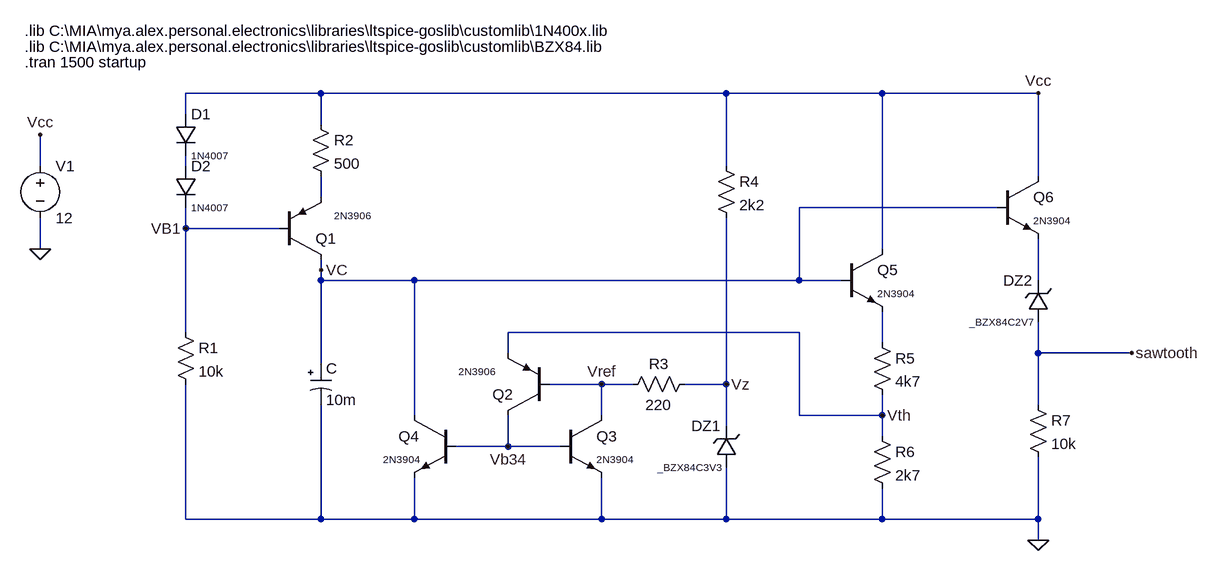
[diagram p0: schematic sawtooth.asc]
sawtooth.asc, the LTspice schematic file:
Version 4
SHEET 1 1076 740
WIRE -1648 -64 -1856 -64
WIRE -1024 -64 -1648 -64
WIRE -784 -64 -1024 -64
WIRE -544 -64 -784 -64
WIRE -1856 -32 -1856 -64
WIRE -1648 -16 -1648 -64
WIRE -2080 48 -2080 0
WIRE -1856 48 -1856 32
WIRE -1024 48 -1024 -64
WIRE -544 64 -544 -64
WIRE -1648 96 -1648 64
WIRE -608 112 -912 112
WIRE -1856 144 -1856 112
WIRE -1712 144 -1856 144
WIRE -2080 176 -2080 128
WIRE -784 176 -784 -64
WIRE -1648 208 -1648 192
WIRE -1648 224 -1648 208
WIRE -1504 224 -1648 224
WIRE -912 224 -912 112
WIRE -912 224 -1504 224
WIRE -848 224 -912 224
WIRE -544 224 -544 160
WIRE -1856 304 -1856 144
WIRE -912 304 -1360 304
WIRE -784 320 -784 272
WIRE -1360 336 -1360 304
WIRE -544 336 -544 288
WIRE -400 336 -544 336
WIRE -1648 352 -1648 224
WIRE -1216 384 -1296 384
WIRE -1168 384 -1216 384
WIRE -1024 384 -1024 128
WIRE -1024 384 -1088 384
WIRE -544 416 -544 336
WIRE -1504 432 -1504 224
WIRE -1216 432 -1216 384
WIRE -912 432 -912 304
WIRE -784 432 -784 400
WIRE -784 432 -912 432
WIRE -1024 448 -1024 384
WIRE -784 464 -784 432
WIRE -1360 480 -1360 432
WIRE -1360 480 -1440 480
WIRE -1280 480 -1360 480
WIRE -1856 592 -1856 384
WIRE -1648 592 -1648 416
WIRE -1648 592 -1856 592
WIRE -1504 592 -1504 528
WIRE -1504 592 -1648 592
WIRE -1216 592 -1216 528
WIRE -1216 592 -1504 592
WIRE -1024 592 -1024 512
WIRE -1024 592 -1216 592
WIRE -784 592 -784 544
WIRE -784 592 -1024 592
WIRE -544 592 -544 496
WIRE -544 592 -784 592
WIRE -544 624 -544 592
FLAG -2080 176 0
FLAG -1856 144 VB1
FLAG -2080 0 Vcc
FLAG -1648 208 VC
FLAG -1360 480 Vb34
FLAG -544 -64 Vcc
FLAG -544 624 0
FLAG -400 336 sawtooth
FLAG -1024 384 Vz
FLAG -784 432 Vth
FLAG -1216 384 Vref
SYMBOL voltage -2080 32 R0
WINDOW 123 0 0 Left 0
WINDOW 39 0 0 Left 0
SYMATTR InstName V1
SYMATTR Value 12
SYMBOL pnp -1712 192 M180
WINDOW 3 84 68 Left 1
SYMATTR Value 2N3906
SYMATTR InstName Q1
SYMBOL res -1664 -32 R0
SYMATTR InstName R2
SYMATTR Value 500
SYMBOL polcap -1664 352 R0
WINDOW 3 24 56 Left 2
SYMATTR Value 10m
SYMATTR InstName C
SYMATTR Description Capacitor
SYMATTR Type cap
SYMBOL res -1872 288 R0
SYMATTR InstName R1
SYMATTR Value 10k
SYMBOL diode -1872 48 R0
WINDOW 3 24 64 Left 1
SYMATTR Value 1N4007
SYMATTR InstName D2
SYMBOL diode -1872 -32 R0
WINDOW 3 24 64 Left 1
SYMATTR Value 1N4007
SYMATTR InstName D1
SYMBOL npn -848 176 R0
WINDOW 3 56 68 Left 1
SYMATTR Value 2N3904
SYMATTR InstName Q5
SYMBOL res -800 304 R0
SYMATTR InstName R5
SYMATTR Value 4k7
SYMBOL zener -1008 512 R180
WINDOW 0 24 64 Left 2
WINDOW 3 24 0 Left 1
SYMATTR InstName DZ1
SYMATTR Value _BZX84C3V3
SYMBOL res -1040 32 R0
SYMATTR InstName R4
SYMATTR Value 2k2
SYMBOL npn -1280 432 R0
WINDOW 3 56 68 Left 1
SYMATTR Value 2N3904
SYMATTR InstName Q3
SYMBOL pnp -1296 432 R180
WINDOW 3 84 68 Left 1
SYMATTR Value 2N3906
SYMATTR InstName Q2
SYMBOL npn -1440 432 M0
WINDOW 3 56 68 Left 1
SYMATTR Value 2N3904
SYMATTR InstName Q4
SYMBOL res -1072 368 R90
WINDOW 0 0 56 VBottom 2
WINDOW 3 32 56 VTop 2
SYMATTR InstName R3
SYMATTR Value 220
SYMBOL res -560 400 R0
SYMATTR InstName R7
SYMATTR Value 10k
SYMBOL npn -608 64 R0
WINDOW 3 56 68 Left 1
SYMATTR Value 2N3904
SYMATTR InstName Q6
SYMBOL res -800 448 R0
SYMATTR InstName R6
SYMATTR Value 2k7
SYMBOL zener -528 288 R180
WINDOW 0 24 64 Left 2
WINDOW 3 24 0 Left 1
SYMATTR InstName DZ2
SYMATTR Value _BZX84C2V7
TEXT -2104 -112 Left 2 !.tran 1500 startup
TEXT -2104 -160 Left 2 !.lib C:\\MIA\\mya.alex.personal.electronics\\libraries\\ltspice-goslib\\customlib\\1N400x.lib
TEXT -2104 -136 Left 2 !.lib C:\\MIA\\mya.alex.personal.electronics\\libraries\\ltspice-goslib\\customlib\\BZX84.lib

The netlist it stands for:
* sawtooth.asc
V1 Vcc 0 12
Q1 VC VB1 N002 0 2N3906
R2 Vcc N002 500
C VC 0 10m
R1 VB1 0 10k
D2 N001 VB1 1N4007
D1 Vcc N001 1N4007
Q5 Vcc VC N004 0 2N3904
R5 N004 Vth 4k7
DZ1 0 Vz _BZX84C3V3
R4 Vcc Vz 2k2
Q3 Vref Vb34 0 0 2N3904
Q2 Vb34 Vref Vth 0 2N3906
Q4 VC Vb34 0 0 2N3904
R3 Vz Vref 220
R7 sawtooth 0 10k
Q6 Vcc VC N003 0 2N3904
R6 Vth 0 2k7
DZ2 sawtooth N003 _BZX84C2V7
.model D D
.lib standard.dio
.model NPN NPN
.model PNP PNP
.lib standard.bjt
.tran 1500 startup
.lib C:\MIA\mya.alex.personal.electronics\libraries\ltspice-goslib\customlib\1N400x.lib
.lib C:\MIA\mya.alex.personal.electronics\libraries\ltspice-goslib\customlib\BZX84.lib
.backanno
.end